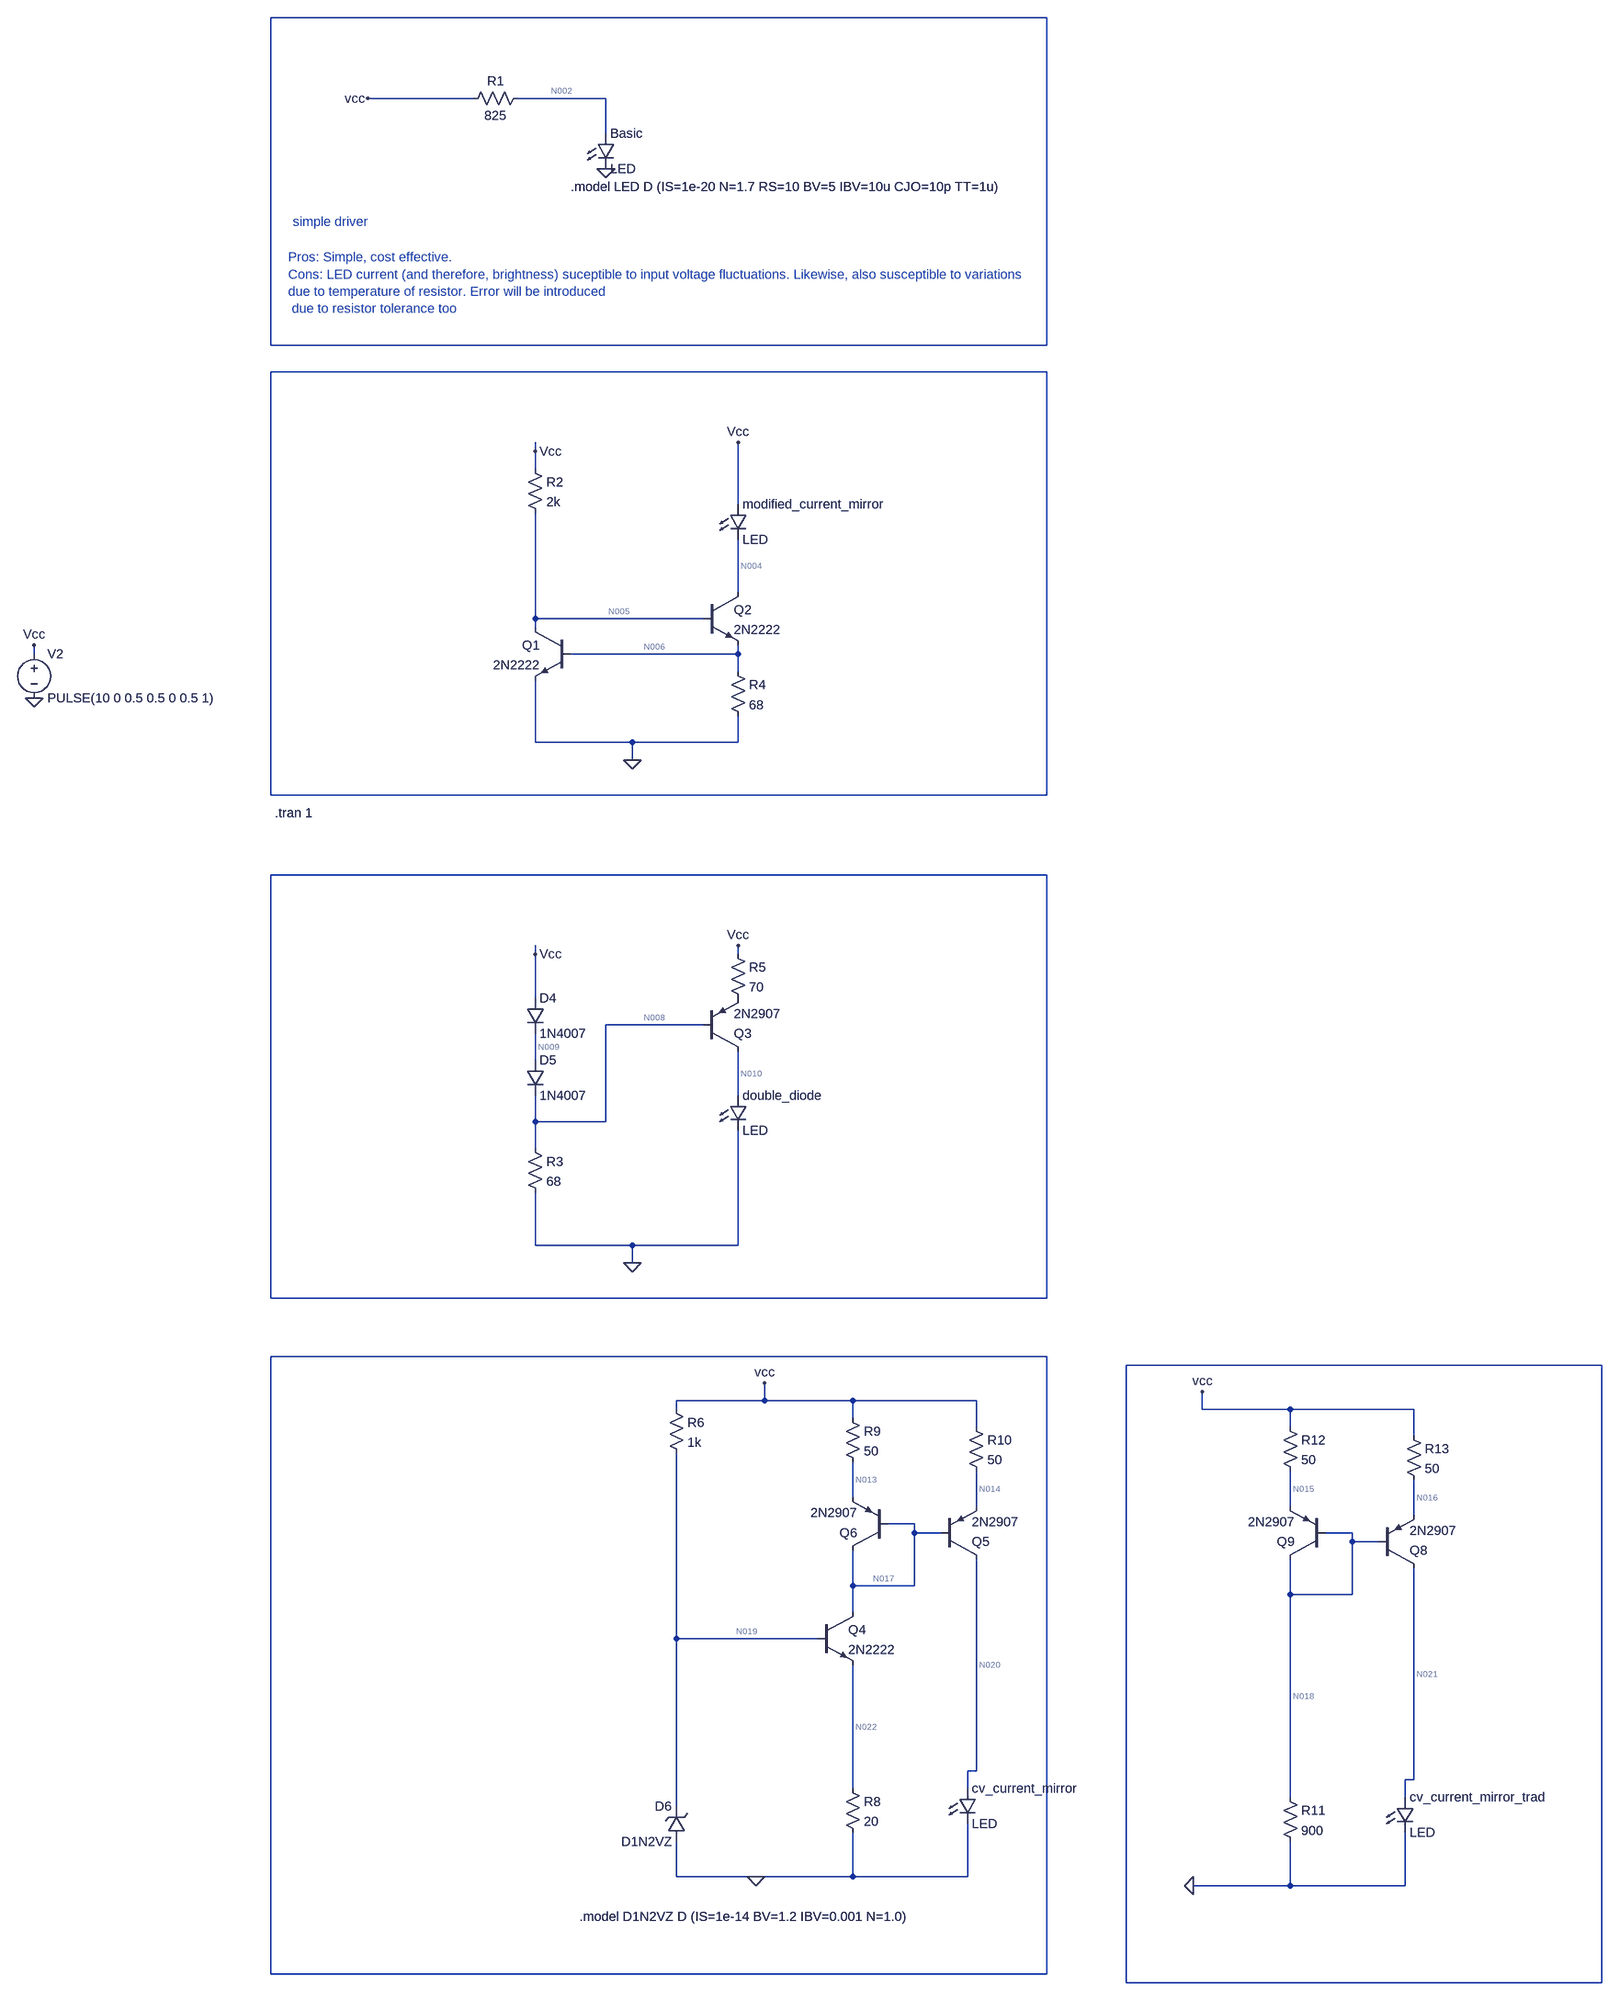
[diagram p0: schematic LED Driver.asc]
LED Driver.asc, the LTspice schematic file:
Version 4
SHEET 1 3188 3668
WIRE 1328 0 -80 0
WIRE 288 208 96 208
WIRE 528 208 368 208
WIRE 528 272 528 208
WIRE -80 656 -80 0
WIRE 1328 656 1328 0
WIRE 1328 656 -80 656
WIRE 1328 704 -80 704
WIRE 400 848 400 832
WIRE 400 880 400 848
WIRE 768 944 768 832
WIRE 768 1104 768 1008
WIRE 400 1152 400 960
WIRE 704 1152 400 1152
WIRE 400 1168 400 1152
WIRE -544 1216 -544 1200
WIRE 768 1216 768 1200
WIRE 768 1216 464 1216
WIRE 768 1248 768 1216
WIRE 400 1376 400 1264
WIRE 576 1376 400 1376
WIRE 768 1376 768 1328
WIRE 768 1376 576 1376
WIRE 576 1408 576 1376
WIRE -80 1472 -80 704
WIRE 1328 1472 1328 704
WIRE 1328 1472 -80 1472
WIRE 1328 1648 -80 1648
WIRE 400 1792 400 1776
WIRE 768 1792 768 1776
WIRE 400 1872 400 1792
WIRE 704 1920 528 1920
WIRE 400 1984 400 1936
WIRE 768 2048 768 1968
WIRE 400 2096 400 2048
WIRE 528 2096 528 1920
WIRE 528 2096 400 2096
WIRE 400 2144 400 2096
WIRE 400 2320 400 2224
WIRE 576 2320 400 2320
WIRE 768 2320 768 2112
WIRE 768 2320 576 2320
WIRE 576 2352 576 2320
WIRE -80 2416 -80 1648
WIRE 1328 2416 1328 1648
WIRE 1328 2416 -80 2416
WIRE 1328 2528 -80 2528
WIRE 3184 2544 1472 2544
WIRE 816 2608 816 2576
WIRE 816 2608 656 2608
WIRE 976 2608 816 2608
WIRE 1200 2608 976 2608
WIRE 656 2624 656 2608
WIRE 2368 2624 2368 2592
WIRE 2528 2624 2368 2624
WIRE 2752 2624 2528 2624
WIRE 976 2640 976 2608
WIRE 1200 2656 1200 2608
WIRE 2528 2656 2528 2624
WIRE 2752 2672 2752 2624
WIRE 976 2784 976 2720
WIRE 1200 2800 1200 2736
WIRE 2528 2800 2528 2736
WIRE 2752 2816 2752 2752
WIRE 1088 2832 1040 2832
WIRE 1088 2848 1088 2832
WIRE 1136 2848 1088 2848
WIRE 2640 2848 2592 2848
WIRE 2640 2864 2640 2848
WIRE 2688 2864 2640 2864
WIRE 976 2944 976 2880
WIRE 1088 2944 1088 2848
WIRE 1088 2944 976 2944
WIRE 2528 2960 2528 2896
WIRE 2640 2960 2640 2864
WIRE 2640 2960 2528 2960
WIRE 976 2992 976 2944
WIRE 656 3040 656 2704
WIRE 912 3040 656 3040
WIRE 1200 3280 1200 2896
WIRE 1200 3280 1184 3280
WIRE 2752 3296 2752 2912
WIRE 2752 3296 2736 3296
WIRE 976 3312 976 3088
WIRE 1184 3312 1184 3280
WIRE 2528 3328 2528 2960
WIRE 2736 3328 2736 3296
WIRE 656 3344 656 3040
WIRE 656 3472 656 3408
WIRE 800 3472 656 3472
WIRE 976 3472 976 3392
WIRE 976 3472 800 3472
WIRE 1184 3472 1184 3376
WIRE 1184 3472 976 3472
WIRE 2528 3488 2528 3408
WIRE 2528 3488 2352 3488
WIRE 2736 3488 2736 3392
WIRE 2736 3488 2528 3488
WIRE -80 3648 -80 2528
WIRE 1328 3648 1328 2528
WIRE 1328 3648 -80 3648
WIRE 1472 3664 1472 2544
WIRE 3184 3664 3184 2544
WIRE 3184 3664 1472 3664
FLAG 528 336 0
FLAG -544 1296 0
FLAG 400 848 Vcc
FLAG -544 1200 Vcc
FLAG 576 1408 0
FLAG 768 832 Vcc
FLAG 400 1792 Vcc
FLAG 576 2352 0
FLAG 768 1776 Vcc
FLAG 816 2576 vcc
FLAG 800 3472 0
FLAG 96 208 vcc
FLAG 2368 2592 vcc
FLAG 2352 3488 0
SYMBOL Res 384 192 R90
WINDOW 0 0 56 VBottom 2
WINDOW 3 32 56 VTop 2
SYMATTR InstName R1
SYMATTR Value 825
SYMBOL LED 512 272 R0
SYMATTR InstName Basic
SYMATTR Value LED
SYMBOL voltage -544 1200 R0
SYMATTR InstName V2
SYMATTR Value PULSE(10 0 0.5 0.5 0 0.5 1)
SYMBOL npn 464 1168 M0
SYMATTR InstName Q1
SYMATTR Value 2N2222
SYMBOL npn 704 1104 R0
SYMATTR InstName Q2
SYMATTR Value 2N2222
SYMBOL Res 384 864 R0
SYMATTR InstName R2
SYMATTR Value 2k
SYMBOL LED 752 944 R0
SYMATTR InstName modified_current_mirror
SYMATTR Value LED
SYMBOL Res 752 1232 R0
SYMATTR InstName R4
SYMATTR Value 68
SYMBOL LED 752 2048 R0
SYMATTR InstName double_diode
SYMATTR Value LED
SYMBOL diode 384 1872 R0
SYMATTR InstName D4
SYMATTR Value 1N4007
SYMBOL Res 384 2128 R0
SYMATTR InstName R3
SYMATTR Value 68
SYMBOL pnp 704 1968 M180
SYMATTR InstName Q3
SYMATTR Value 2N2907
SYMBOL Res 752 1776 R0
SYMATTR InstName R5
SYMATTR Value 70
SYMBOL diode 384 1984 R0
SYMATTR InstName D5
SYMATTR Value 1N4007
SYMBOL npn 912 2992 R0
SYMATTR InstName Q4
SYMATTR Value 2N2222
SYMBOL Res 640 2608 R0
SYMATTR InstName R6
SYMATTR Value 1k
SYMBOL Res 960 3296 R0
SYMATTR InstName R8
SYMATTR Value 20
SYMBOL zener 672 3408 R180
WINDOW 0 24 64 Left 2
WINDOW 3 24 0 Left 2
SYMATTR InstName D6
SYMATTR Value D1N2VZ
SYMATTR Description Diode
SYMATTR Type diode
SYMBOL pnp 1136 2896 M180
SYMATTR InstName Q5
SYMATTR Value 2N2907
SYMBOL pnp 1040 2880 R180
SYMATTR InstName Q6
SYMATTR Value 2N2907
SYMBOL Res 960 2624 R0
SYMATTR InstName R9
SYMATTR Value 50
SYMBOL Res 1184 2640 R0
SYMATTR InstName R10
SYMATTR Value 50
SYMBOL LED 1168 3312 R0
SYMATTR InstName cv_current_mirror
SYMATTR Value LED
SYMBOL Res 2512 3312 R0
SYMATTR InstName R11
SYMATTR Value 900
SYMBOL pnp 2688 2912 M180
SYMATTR InstName Q8
SYMATTR Value 2N2907
SYMBOL pnp 2592 2896 R180
SYMATTR InstName Q9
SYMATTR Value 2N2907
SYMBOL Res 2512 2640 R0
SYMATTR InstName R12
SYMATTR Value 50
SYMBOL Res 2736 2656 R0
SYMATTR InstName R13
SYMATTR Value 50
SYMBOL LED 2720 3328 R0
SYMATTR InstName cv_current_mirror_trad
SYMATTR Value LED
TEXT 464 368 Left 2 !.model LED D (IS=1e-20 N=1.7 RS=10 BV=5 IBV=10u CJO=10p TT=1u)
TEXT -72 1504 Left 2 !.tran 1
TEXT -40 432 Left 2 ;simple driver
TEXT -48 496 Left 2 ;Pros: Simple, cost effective.\nCons: LED current (and therefore, brightness) suceptible to input voltage fluctuations. Likewise, also susceptible to variations \ndue to temperature of resistor. Error will be introduced\n due to resistor tolerance too
TEXT 480 3544 Left 2 !.model D1N2VZ D (IS=1e-14 BV=1.2 IBV=0.001 N=1.0)

The netlist it stands for:
* LED Driver.asc
R1 N002 Vcc 825
D§Basic N002 0 LED
V2 Vcc 0 PULSE(10 0 0.5 0.5 0 0.5 1)
Q1 N005 N006 0 0 2N2222
Q2 N004 N005 N006 0 2N2222
R2 Vcc N005 2k
D§modified_current_mirror Vcc N004 LED
R4 N006 0 68
double_diode N010 0 LED
D4 Vcc N009 1N4007
R3 N008 0 68
Q3 N010 N008 P001 0 2N2907
R5 Vcc P001 70
D5 N009 N008 1N4007
Q4 N017 N019 N022 0 2N2222
R6 Vcc N019 1k
R8 N022 0 20
D6 0 N019 D1N2VZ
Q5 N020 N017 N014 0 2N2907
Q6 N017 N017 N013 0 2N2907
R9 Vcc N013 50
R10 Vcc N014 50
D§cv_current_mirror N020 0 LED
R11 N018 0 900
Q8 N021 N018 N016 0 2N2907
Q9 N018 N018 N015 0 2N2907
R12 Vcc N015 50
R13 Vcc N016 50
D§cv_current_mirror_trad N021 0 LED
.model D D
.lib standard.dio
.model NPN NPN
.model PNP PNP
.lib standard.bjt
.model LED D (IS=1e-20 N=1.7 RS=10 BV=5 IBV=10u CJO=10p TT=1u)
.tran 1
* simple driver
* Pros: Simple, cost effective.
* Cons: LED current (and therefore, brightness) suceptible to input voltage fluctuations. Likewise, also susceptible to variations
* due to temperature of resistor. Error will be introduced
*  due to resistor tolerance too
.model D1N2VZ D (IS=1e-14 BV=1.2 IBV=0.001 N=1.0)
.backanno
.end

* Results of the author's LTspice run, read from the files saved beside the schematic
* Operating Point, zero values left out:
*   V(n002) = 1.919 V
*   V(vcc) = 10 V
*   V(n005) = 1.411 V
*   V(n006) = 693.8 mV
*   V(n004) = 8.075 V
*   V(n010) = 1.945 V
*   V(n009) = 9.233 V
*   V(n008) = 8.466 V
*   V(p001) = 9.187 V
*   V(n017) = 7.989 V
*   V(n019) = 1.256 V
*   V(n022) = 510.3 mV
*   V(n020) = 2.115 V
*   V(n014) = 8.735 V
*   V(n013) = 8.736 V
*   V(n018) = 8.796 V
*   V(n021) = 1.918 V
*   V(n016) = 9.512 V
*   V(n015) = 9.513 V
*   Ic(Q1) = 4.246 mA
*   Ib(Q1) = 21.37 µA
*   Ie(Q1) = -4.267 mA
*   Ic(Q2) = 10.17 mA
*   Ib(Q2) = 49.21 µA
*   Ie(Q2) = -10.22 mA
*   Ic(Q4) = 25.38 mA
*   Ib(Q4) = 128.4 µA
*   Ie(Q4) = -25.51 mA
*   Ic(Q3) = -11.58 mA
*   Ib(Q3) = -45.52 µA
*   Ie(Q3) = 11.62 mA
*   Ic(Q5) = -25.2 mA
*   Ib(Q5) = -103.8 µA
*   Ie(Q5) = 25.31 mA
*   Ic(Q6) = -25.17 mA
*   Ib(Q6) = -109.1 µA
*   Ie(Q6) = 25.28 mA
*   Ic(Q8) = -9.726 mA
*   Ib(Q8) = -37.92 µA
*   Ie(Q8) = 9.764 mA
*   Ic(Q9) = -9.696 mA
*   Ib(Q9) = -40.04 µA
*   Ie(Q9) = 9.736 mA
*   I(Basic) = 9.795 mA
*   I(Modified_current_mirror) = 10.17 mA
*   I(Double_diode) = 11.58 mA
*   I(Cv_current_mirror) = 25.2 mA
*   I(Cv_current_mirror_trad) = 9.726 mA
*   I(D4) = 124.5 mA
*   I(D5) = 124.5 mA
*   I(D6) = -8.616 mA
*   I(R1) = -9.795 mA
*   I(R2) = 4.295 mA
*   I(R4) = 10.2 mA
*   I(R3) = 124.5 mA
*   I(R5) = 11.62 mA
*   I(R6) = 8.744 mA
*   I(R8) = 25.51 mA
*   I(R9) = 25.28 mA
*   I(R10) = 25.31 mA
*   I(R11) = 9.774 mA
*   I(R12) = 9.736 mA
*   I(R13) = 9.764 mA
*   I(V2) = -239.2 mA
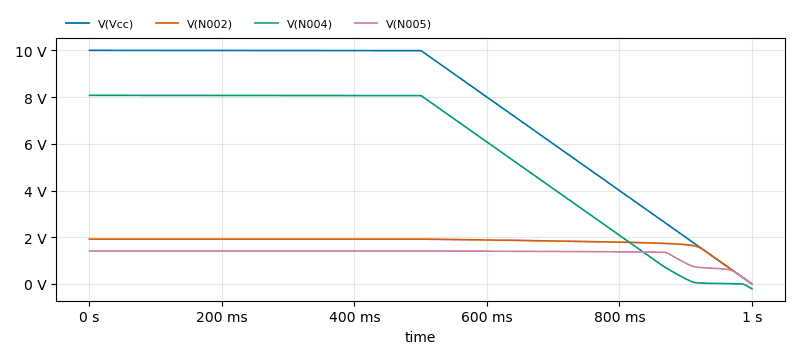
[diagram p1: Transient Analysis of LED Driver.asc, plotted from the saved traces]
* Transient Analysis, 1 run:
*   V(Vcc): min 0 V, max 10 V, average 7.497 V, rms 8.186 V, last 0 V
*   V(N002): min 0 V, max 1.919 V, average 1.789 V, rms 1.819 V, last 0 V
*   V(N004): min -207.4 mV, max 8.075 V, average 5.67 V, rms 6.462 V, last -207.4 mV
*   V(N005): min 1.338 µV, max 1.411 V, average 1.311 V, rms 1.337 V, last 1.338 µV